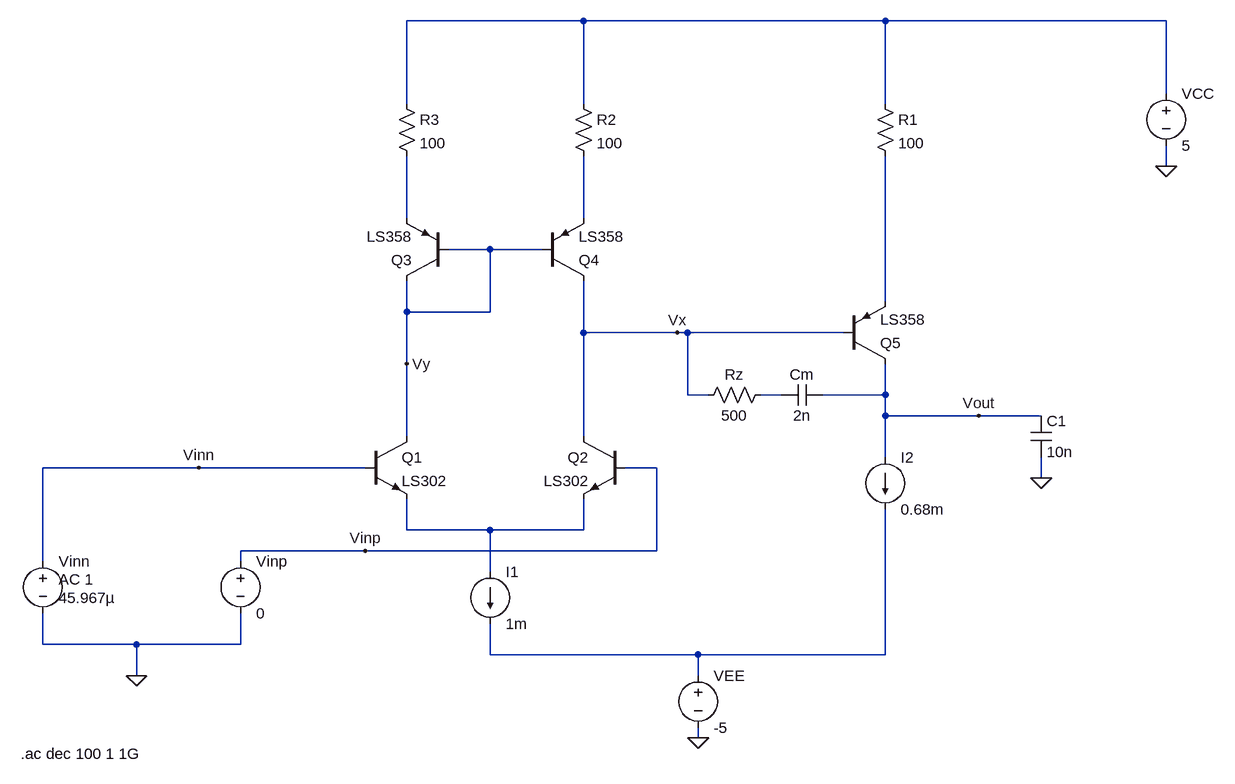
[diagram p0: schematic Q3_amplifier.asc]
Q3_amplifier.asc, the LTspice schematic file:
Version 4
SHEET 1 1428 768
WIRE 432 -480 160 -480
WIRE 896 -480 432 -480
WIRE 1328 -480 896 -480
WIRE 1328 -368 1328 -480
WIRE 160 -352 160 -480
WIRE 432 -352 432 -480
WIRE 896 -352 896 -480
WIRE 1328 -256 1328 -288
WIRE 160 -176 160 -272
WIRE 432 -176 432 -272
WIRE 288 -128 224 -128
WIRE 368 -128 288 -128
WIRE 896 -48 896 -272
WIRE 160 -32 160 -80
WIRE 288 -32 288 -128
WIRE 288 -32 160 -32
WIRE 432 0 432 -80
WIRE 576 0 432 0
WIRE 592 0 576 0
WIRE 832 0 592 0
WIRE 160 48 160 -32
WIRE 592 96 592 0
WIRE 624 96 592 96
WIRE 736 96 704 96
WIRE 896 96 896 48
WIRE 896 96 800 96
WIRE 896 128 896 96
WIRE 1040 128 896 128
WIRE 1136 128 1040 128
WIRE 160 160 160 48
WIRE 432 160 432 0
WIRE 896 192 896 128
WIRE -160 208 -400 208
WIRE 96 208 -160 208
WIRE 544 208 496 208
WIRE 1136 224 1136 192
WIRE 160 304 160 256
WIRE 288 304 160 304
WIRE 432 304 432 256
WIRE 432 304 288 304
WIRE 96 336 -96 336
WIRE 544 336 544 208
WIRE 544 336 96 336
WIRE -400 352 -400 208
WIRE -96 352 -96 336
WIRE 288 368 288 304
WIRE -400 480 -400 432
WIRE -256 480 -400 480
WIRE -96 480 -96 432
WIRE -96 480 -256 480
WIRE 288 496 288 448
WIRE 608 496 288 496
WIRE 896 496 896 272
WIRE 896 496 608 496
WIRE -256 528 -256 480
WIRE 608 528 608 496
WIRE 608 624 608 608
FLAG 608 624 0
FLAG 1328 -256 0
FLAG -256 528 0
FLAG 1136 224 0
FLAG -160 208 Vinn
FLAG 96 336 Vinp
FLAG 160 48 Vy
FLAG 576 0 Vx
FLAG 1040 128 Vout
SYMBOL npn 96 160 R0
SYMATTR InstName Q1
SYMATTR Value LS302
SYMBOL npn 496 160 M0
SYMATTR InstName Q2
SYMATTR Value LS302
SYMBOL pnp 224 -80 R180
SYMATTR InstName Q3
SYMATTR Value LS358
SYMBOL pnp 368 -80 M180
SYMATTR InstName Q4
SYMATTR Value LS358
SYMBOL pnp 832 48 M180
SYMATTR InstName Q5
SYMATTR Value LS358
SYMBOL res 880 -368 R0
SYMATTR InstName R1
SYMATTR Value 100
SYMBOL res 416 -368 R0
SYMATTR InstName R2
SYMATTR Value 100
SYMBOL res 144 -368 R0
SYMATTR InstName R3
SYMATTR Value 100
SYMBOL voltage -400 336 R0
WINDOW 123 24 44 Left 2
WINDOW 39 0 0 Left 0
WINDOW 3 24 72 Left 2
SYMATTR Value2 AC 1
SYMATTR Value 45.967µ
SYMATTR InstName Vinn
SYMBOL voltage -96 336 R0
WINDOW 123 0 0 Left 0
WINDOW 39 0 0 Left 0
SYMATTR InstName Vinp
SYMATTR Value 0
SYMBOL voltage 1328 -384 R0
WINDOW 123 0 0 Left 0
WINDOW 39 0 0 Left 0
SYMATTR InstName VCC
SYMATTR Value 5
SYMBOL voltage 608 512 R0
WINDOW 123 0 0 Left 0
WINDOW 39 0 0 Left 0
SYMATTR InstName VEE
SYMATTR Value -5
SYMBOL current 288 368 R0
WINDOW 123 0 0 Left 0
WINDOW 39 0 0 Left 0
SYMATTR InstName I1
SYMATTR Value 1m
SYMBOL current 896 192 R0
WINDOW 123 0 0 Left 0
WINDOW 39 0 0 Left 0
SYMATTR InstName I2
SYMATTR Value 0.68m
SYMBOL cap 1120 128 R0
SYMATTR InstName C1
SYMATTR Value 10n
SYMBOL res 720 80 R90
WINDOW 0 0 56 VBottom 2
WINDOW 3 32 56 VTop 2
SYMATTR InstName Rz
SYMATTR Value 500
SYMBOL cap 800 80 R90
WINDOW 0 0 32 VBottom 2
WINDOW 3 32 32 VTop 2
SYMATTR InstName Cm
SYMATTR Value 2n
TEXT -434 648 Left 2 !.ac dec 100 1 1G

The netlist it stands for:
* Q3_amplifier.asc
Q1 Vy Vinn N006 0 LS302
Q2 Vx Vinp N006 0 LS302
Q3 Vy Vy N002 0 LS358
Q4 Vx Vy N003 0 LS358
Q5 Vout Vx N004 0 LS358
R1 N001 N004 100
R2 N001 N003 100
R3 N001 N002 100
Vinn Vinn 0 45.967µ AC 1
Vinp Vinp 0 0
VCC N001 0 5
VEE N007 0 -5
I1 N006 N007 1m
I2 Vout N007 0.68m
C1 Vout 0 10n
Rz N005 Vx 500
Cm Vout N005 2n
.model NPN NPN
.model PNP PNP
.lib standard.bjt
.ac dec 100 1 1G
.backanno
.end